# EAGLE schematic untitled (EAGLE 9.3.1)
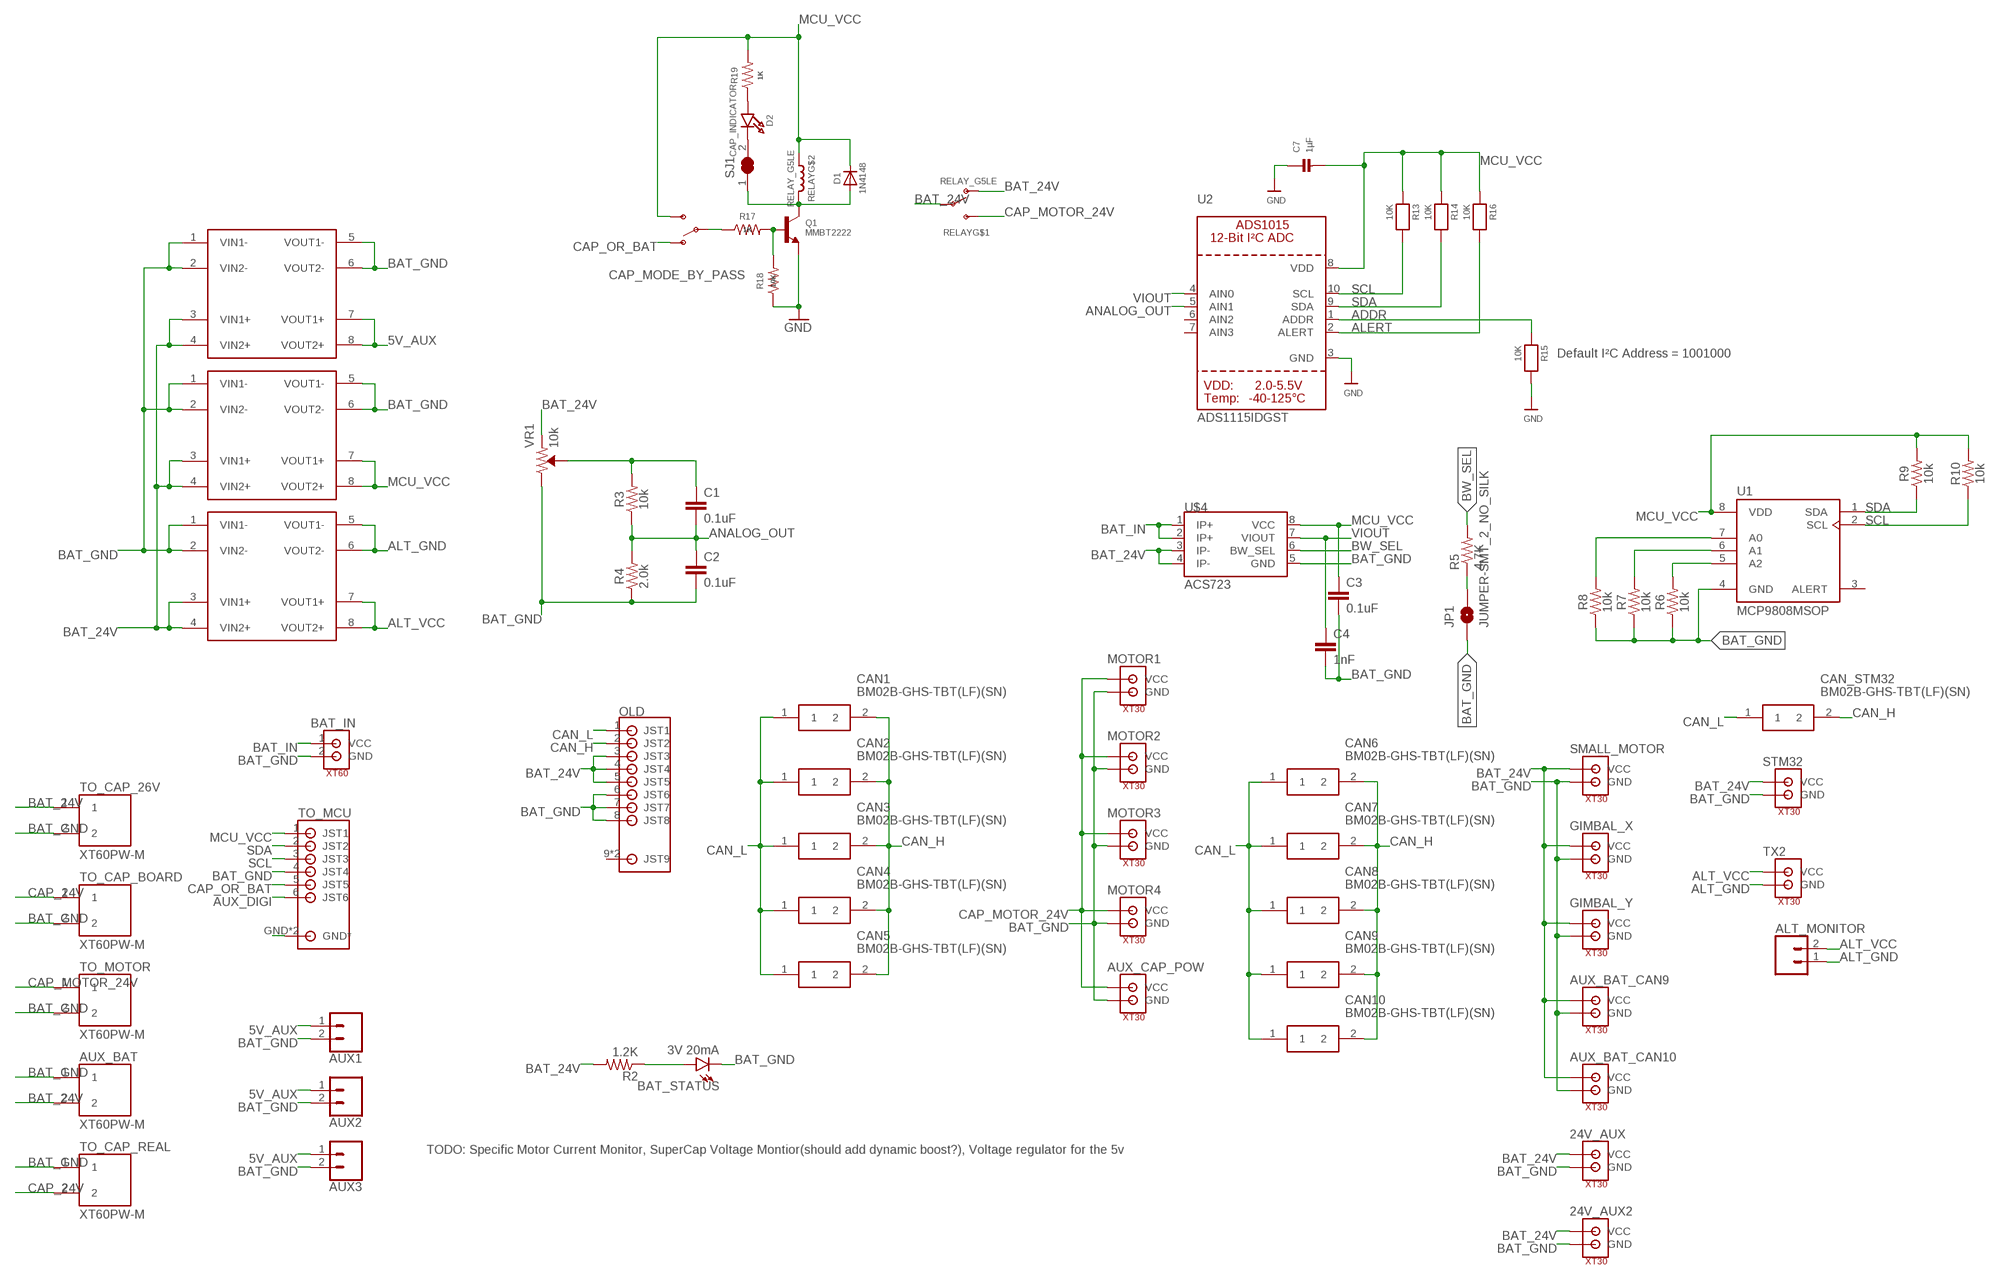
[diagram p0: schematic, sheet 1]

## Parts
24V_AUX  XT30  [XT30]
24V_AUX2  XT30  [XT30]
ALT_MONITOR  CONN_02  [1X02]
AUX1  CONN_02  [1X02]
AUX2  CONN_02  [1X02]
AUX3  CONN_02  [1X02]
AUX_BAT  XT60PW-M  [AMASS_XT60PW-M]
AUX_BAT_CAN9  XT30  [XT30]
AUX_BAT_CAN10  XT30  [XT30]
AUX_CAP_POW  XT30  [XT30]
BAT_IN  XT60  [XT60]
BAT_STATUS  3V 20mA  LED1206  [LED-1206]
C1  0.1uF  0.1UF-0603-25V-(+80/-20%)  [0603]
C2  0.1uF  0.1UF-0603-25V-(+80/-20%)  [0603]
C3  0.1uF  0.1UF-0603-25V-(+80/-20%)  [0603]
C4  1nF  1.0NF/1000PF-0603-50V-10%  [0603]
C7  1µF  CAP_CERAMIC0805  [0805]
CAN1  BM02B-GHS-TBT(LF)(SN)  [BM02B-GHS-TBT_1]
CAN2  BM02B-GHS-TBT(LF)(SN)  [BM02B-GHS-TBT_1]
CAN3  BM02B-GHS-TBT(LF)(SN)  [BM02B-GHS-TBT_1]
CAN4  BM02B-GHS-TBT(LF)(SN)  [BM02B-GHS-TBT_1]
CAN5  BM02B-GHS-TBT(LF)(SN)  [BM02B-GHS-TBT_1]
CAN6  BM02B-GHS-TBT(LF)(SN)  [BM02B-GHS-TBT_1]
CAN7  BM02B-GHS-TBT(LF)(SN)  [BM02B-GHS-TBT_1]
CAN8  BM02B-GHS-TBT(LF)(SN)  [BM02B-GHS-TBT_1]
CAN9  BM02B-GHS-TBT(LF)(SN)  [BM02B-GHS-TBT_1]
CAN10  BM02B-GHS-TBT(LF)(SN)  [BM02B-GHS-TBT_1]
CAN_STM32  BM02B-GHS-TBT(LF)(SN)  [BM02B-GHS-TBT_1]
CAP_MODE_BY_PASS  SWITCH-SPDT-SMD-RIGHT-ANGLE  [SWITCH_SPST_SMD_A]
D1  1N4148  DIODESOD-323  [SOD-323]
D2  CAP_INDICATOR  LED0805_NOOUTLINE  [CHIPLED_0805_NOOUTLINE]
GIMBAL_X  XT30  [XT30]
GIMBAL_Y  XT30  [XT30]
JP1  JUMPER-SMT_2_NO_SILK  [SMT-JUMPER_2_NO_SILK]
MOTOR1  XT30  [XT30]
MOTOR2  XT30  [XT30]
MOTOR3  XT30  [XT30]
MOTOR4  XT30  [XT30]
OLD  S8B-PH-SM4_TB  [S8B-PH-SM4_TB]
Q1  MMBT2222  TRANSISTOR_NPN  [SOT23-R]
R2  1.2K  RESISTOR2010  [R2010]
R3  10k  10KOHM-0603-1/10W-1%  [0603]
R4  2.0k  2.0KOHM-0603-1/10W-5%  [0603]
R5  4.7K  4.7KOHM-1/10W-1%(0603)  [0603-RES]
R6  10k  10KOHM-0603-1/10W-1%  [0603]
R7  10k  10KOHM-0603-1/10W-1%  [0603]
R8  10k  10KOHM-0603-1/10W-1%  [0603]
R9  10k  10KOHM-0603-1/10W-1%  [0603]
R10  10k  10KOHM-0603-1/10W-1%  [0603]
R13  10K  RESISTOR0805  [0805]
R14  10K  RESISTOR0805  [0805]
R15  10K  RESISTOR0805  [0805]
R16  10K  RESISTOR0805  [0805]
R17  1K  RESISTOR0805-RES  [0805]
R18  10K  RESISTOR0805-RES  [0805]
R19  1K  RESISTOR0805-RES  [0805]
RELAY  RELAY_G5LE  [RELAY_G5LE-1]
SJ1  SOLDERJUMPER_CLOSED  [SOLDERJUMPER_CLOSEDWIRE]
SMALL_MOTOR  XT30  [XT30]
STM32  XT30  [XT30]
TO_CAP_26V  XT60PW-M  [AMASS_XT60PW-M]
TO_CAP_BOARD  XT60PW-M  [AMASS_XT60PW-M]
TO_CAP_REAL  XT60PW-M  [AMASS_XT60PW-M]
TO_MCU  S6B-PH-SM4_TB  [S6B-PH-SM4_TB]
TO_MOTOR  XT60PW-M  [AMASS_XT60PW-M]
TX2  XT30  [XT30]
U1  MCP9808MSOP  [MSOP-8]
U2  ADS1115IDGST  ADC_ADS1015  [MSOP10]
U$1  MP1584  [MP1584_AMAZON]
U$2  MP1584  [MP1584_AMAZON]
U$4  ACS723  [SO08]
U$5  MP1584  [MP1584_AMAZON]
VR1  10k  TRIMPOT-SMD-3MM-OPEN-1/10W-25%  [TRIMPOT-SMD-TC33X]

## Nets
5V_AUX: AUX1.1 AUX2.1 AUX3.1 U$5.7(VOUT1+) U$5.8(VOUT2+)
ADDR [sig]: R15.1 U2.1(ADDR)
ALERT [sig]: R16.2 U2.2(ALERT)
ALT_GND [sig]: ALT_MONITOR.1 TX2.P$1(GND) U$2.5(VOUT1-) U$2.6(VOUT2-)
ALT_VCC [sig]: ALT_MONITOR.2 TX2.P$2(VCC) U$2.7(VOUT1+) U$2.8(VOUT2+)
ANALOG_OUT [sig]: C1.2 C2.1 R3.1 R4.2 U2.5(AIN1)
AUX_DIGI: TO_MCU.6(JST6)
BAT_24V: 24V_AUX2.P$2(VCC) 24V_AUX.P$2(VCC) AUX_BAT.2 AUX_BAT_CAN9.P$2(VCC) AUX_BAT_CAN10.P$2(VCC) GIMBAL_X.P$2(VCC) GIMBAL_Y.P$2(VCC) OLD.3(JST3) OLD.4(JST4) OLD.5(JST5) R2.2 RELAY.1(P) RELAY.3(O) SMALL_MOTOR.P$2(VCC) STM32.P$2(VCC) TO_CAP_26V.1 U$1.3(VIN1+) U$1.4(VIN2+) U$2.3(VIN1+) U$2.4(VIN2+) U$4.3(IP-) U$4.4(IP-) U$5.3(VIN1+) U$5.4(VIN2+) VR1.3(CCW)
BAT_GND: 24V_AUX2.P$1(GND) 24V_AUX.P$1(GND) AUX1.2 AUX2.2 AUX3.2 AUX_BAT.1 AUX_BAT_CAN9.P$1(GND) AUX_BAT_CAN10.P$1(GND) AUX_CAP_POW.P$1(GND) BAT_IN.2(GND) BAT_STATUS.C C2.2 C3.2 C4.2 GIMBAL_X.P$1(GND) GIMBAL_Y.P$1(GND) JP1.1 MOTOR1.P$1(GND) MOTOR2.P$1(GND) MOTOR3.P$1(GND) MOTOR4.P$1(GND) OLD.6(JST6) OLD.7(JST7) OLD.8(JST8) R4.1 R6.1 R7.1 R8.1 SMALL_MOTOR.P$1(GND) STM32.P$1(GND) TO_CAP_26V.2 TO_CAP_BOARD.2 TO_CAP_REAL.1 TO_MCU.4(JST4) TO_MOTOR.2 U1.4(GND) U$1.1(VIN1-) U$1.2(VIN2-) U$1.5(VOUT1-) U$1.6(VOUT2-) U$2.1(VIN1-) U$2.2(VIN2-) U$4.5(GND) U$5.1(VIN1-) U$5.2(VIN2-) U$5.5(VOUT1-) U$5.6(VOUT2-) VR1.1(CW)
BAT_IN: BAT_IN.1(VCC) U$4.1(IP+) U$4.2(IP+)
BW_SEL [sig]: R5.2 U$4.6(BW_SEL)
CAN_H [sig]: CAN1.2 CAN2.2 CAN3.2 CAN4.2 CAN5.2 CAN6.2 CAN7.2 CAN8.2 CAN9.2 CAN10.2 CAN_STM32.2 OLD.2(JST2)
CAN_L [sig]: CAN1.1 CAN2.1 CAN3.1 CAN4.1 CAN5.1 CAN6.1 CAN7.1 CAN8.1 CAN9.1 CAN10.1 CAN_STM32.1 OLD.1(JST1)
CAP_24V: TO_CAP_BOARD.1 TO_CAP_REAL.2
CAP_MOTOR_24V: AUX_CAP_POW.P$2(VCC) MOTOR1.P$2(VCC) MOTOR2.P$2(VCC) MOTOR3.P$2(VCC) MOTOR4.P$2(VCC) RELAY.4(S) TO_MOTOR.1
CAP_OR_BAT: CAP_MODE_BY_PASS.1(O) TO_MCU.5(JST5)
GND: C7.1 Q1.2(E) R15.2 R18.1 U2.3(GND)
MCU_VCC [sig]: C3.1 C7.2 CAP_MODE_BY_PASS.3(S) D1.C R9.2 R10.2 R13.1 R14.1 R16.1 R19.2 RELAY.2 TO_MCU.1(JST1) U1.8(VDD) U2.8(VDD) U$1.7(VOUT1+) U$1.8(VOUT2+) U$4.8(VCC)
N$1 [sig]: CAP_MODE_BY_PASS.2(P) R17.1
N$4 [sig]: JP1.2 R5.1
N$5 [sig]: BAT_STATUS.A R2.1
N$7: TO_MCU.GND2(GND*) TO_MCU.GND(GND*)
N$8 [sig]: C1.1 R3.2 VR1.2(WIPER)
N$12: D1.A Q1.3(C) RELAY.5 SJ1.1
N$13 [sig]: R8.2 U1.7(A0)
N$14 [sig]: R7.2 U1.6(A1)
N$15 [sig]: R6.2 U1.5(A2)
N$22: Q1.1(B) R17.2 R18.2
N$25: D2.C SJ1.2
N$26: D2.A R19.1
SCL [sig]: R10.1 R13.2 TO_MCU.3(JST3) U1.2(SCL) U2.10(SCL)
SDA [sig]: R9.1 R14.2 TO_MCU.2(JST2) U1.1(SDA) U2.9(SDA)
VIOUT [sig]: C4.1 U2.4(AIN0) U$4.7(VIOUT)
Unconnected: OLD.9(JST9) OLD.10(JST9) U1.3(ALERT) U2.6(AIN2) U2.7(AIN3)

## Notes on the sheet
- Default I²C Address = 1001000
- TODO: Specific Motor Current Monitor, SuperCap Voltage Montior(should add dynamic boost?), Voltage regulator for the 5v

## Library data of the parts
24V_AUX 24V_AUX2 AUX_BAT_CAN9 AUX_BAT_CAN10 AUX_CAP_POW GIMBAL_X GIMBAL_Y MOTOR1-MOTOR4 SMALL_MOTOR STM32 TX2 = NewKevinMade:XT30
ALT_MONITOR AUX1-AUX3 = SparkFun-Connectors:CONN_02: Multi connection point. Often used as Generic Header-pin footprint for 0.1 inch spaced/style header connections On any of the 0.1 inch spaced packages, you can populate with these: Break Away Headers - Straight <https://www.sparkfun.com/products/116> (PRT-00116) Break Away Male Headers - Right Angle <https://www.sparkfun.com/products/553> (PRT-00553) Female Headers <https://www.sparkfun.com/products/115> (PRT-00115) Break Away Headers - Machine Pin <https://www.sparkfun.com/products/117> (PRT-00117) Break Away Female Headers - Swiss Machine Pin <https://www.sparkfun.com/products/743> (PRT-00743) For SCREWTERMINALS and SPRING TERMINALS visit here: Screw Terimnals on SparkFun.com <https://www.sparkfun.com/search/results?term=Screw+Terminals> (5mm/3.5mm/2.54mm spacing) This device is also useful as a general connection point to wire up your design to another part of your project. Our various solder wires solder well into these plated through hole pads. Hook-Up Wire - Assortment (Stranded, 22 AWG) <https://www.sparkfun.com/products/11375> (PRT-11375) Hook-Up Wire - Assortment (Solid Core, 22 AWG) <https://www.sparkfun.com/products/11367> (PRT-11367) View the entire wire category on our website here <https://www.sparkfun.com/categories/141> Special notes: Molex polarized connector foot print use with: PRT-08233 with associated crimp pins and housings. 2.54_SCREWTERM for use with PRT-10571. 3.5mm Screw Terminal footprints for PRT-08084 5mm Screw Terminal footprints for use with PRT-08432
AUX_BAT TO_CAP_26V TO_CAP_BOARD TO_CAP_REAL TO_MOTOR = XT60PW-M:XT60PW-M; AVAILABILITY: Unavailable; MF: AMASS; MP: XT60PW-M; PACKAGE: Package Analog Devices; PRICE: None
BAT_IN = NewKevinMade:XT60
BAT_STATUS = SparkFun-LED:LED: LED (Generic) Standard schematic elements and footprints for 5mm, 3mm, 1206, and 0603 sized LEDs. Generic LEDs with no color specified.
C1-C3 = SparkFun-Capacitors:0.1UF: 0.1µF ceramic capacitors A capacitor is a passive two-terminal electrical component used to store electrical energy temporarily in an electric field.; PROD_ID: CAP-00810
C4 = SparkFun-Capacitors:1.0NF/1000PF: 1nF/1,000pF ceramic capacitors A capacitor is a passive two-terminal electrical component used to store electrical energy temporarily in an electric field.; PROD_ID: CAP-07886
C7 = microbuilder:CAP_CERAMIC: Ceramic Capacitors 0402 - 0402 Surface Mount Capacitors 16pF 50V 5% [Digikey: 445-4899-2-ND] 18pF 50V 5% [Digikey: 490-1281-2-ND] 22pF 50V 5% [Digikey: 490-1283-2-ND] 68pF 50V 5% [Digikey: 490-1289-2-ND] 0.1uF 10V 10% [Digikey: 490-1318-2-ND] 1.0uF 6.3V 10% [Digikey: 490-1320-2-ND] 0603 - 0603 Surface Mount Capacitors 16 pF 50V 5% [Digikey: 445-5051-2-ND] 22 pF 50V [Digikey: PCC220ACVTR-ND] 33 pF 50V 5% [Digikey: 490-1415-1-ND] 56pF 50V 5% [Digikey: 490-1421-1-ND] 220pF 50V 5% [Digikey: 445-1285-1-ND] 680 pF 50V 2200 pF 50V 5% C0G [Digikey: 445-1297-1-ND] 5600 pF 100V 5% X7R [Digikey: 478-3711-1-ND] 0.1 µF 25V 10% [Digikey: PCC2277TR-ND] 0.22 µF 16V 10% X7R [Digikey: 445-1318-1-ND] 1.0 µF 25V 10% [Digikey: 445-5146-2-ND] 0603 - RF Specific 3pF 250V +/-0.1pF RF [Digikey: 712-1347-1-ND] 18 pF 250V 5% [Digikey: 478-3505-1-ND or 712-1322-1-ND] 56 pF 250V 5% C0G RF [Digikey: 490-4867-1-ND] 68 pF 250V RF [Digikey: 490-4868-1-ND] 0805 - 0805 Surface Mount Capacitors 220 pF 250V 2% RF Ceramic Capacitor [Digikey: 712-1398-1-ND] 1000 pF 50V 2% NP0 Ceramic Capacitor [Digikey: 478-3760-1-ND] 0.1 µF 25V 10% Ceramic Capacitor [Digikey: PCC1828TR-ND] 1.0 µF 16V 10% Ceramic Capacitor[Digikey: 490-1691-2-ND] 10.0 µF 10V 10% Ceramic Capacitor[Digikey: 709-1228-1-ND] 10.0 uF 16V 10% Ceramic Capacitor [Digikey: 478-5165-2-ND] 47 uF 6.3V 20% Ceramic Capacitor [Digikey: 587-1779-1-ND or 399-5506-1-ND] 1206 - 1206 Surface Mount Capacitors 47uF 10V 20% Ceramic Capacitor [Digikey: 490-5528-1-ND or 399-5508-1-ND or 445-6010-1-ND] 100uF 6.3V -20%, +80% Y5V Ceramic Capacitor (Digikey: 490-4512-1-ND, Mouser: 81-GRM31CF50J107ZE1L)
CAN1-CAN10 CAN_STM32 = SamacSys_Parts:BM02B-GHS-TBT(LF)(SN): GH 1.25mm header top entry 2 way JST GH Series, 1.25mm Pitch 2 Way Shrouded Straight PCB Header, Surface Mount, Solder Termination Source: Datasheet <http://uk.rs-online.com/web/p/products/7521762P>; DESCRIPTION: GH 1.25mm header top entry 2 way JST GH Series, 1.25mm Pitch 2 Way Shrouded Straight PCB Header, Surface Mount, Solder Termination; HEIGHT: mm; MANUFACTURER_NAME: JST (JAPAN SOLDERLESS TERMINALS); MANUFACTURER_PART_NUMBER: BM02B-GHS-TBT(LF)(SN); RS_PART_NUMBER: 7521762P
CAP_MODE_BY_PASS = SparkFun-Switches:SWITCH-SPDT: Single Pole, Double Throw (SPDT) Switch Single-pole, double-throw (SPDT) switch. Variant Overview SMD-AYZ0202 Surface Mount DPDT Switch <https://www.sparkfun.com/products/597> (COM-00597) Used on e.g. LilyPad Arduino USB - ATmega32U4 Board <https://www.sparkfun.com/products/12049> PTH-11.6X4.0MM SPDT Mini Power Switch <https://www.sparkfun.com/products/102> (COM-00102) Used on e.g. SparkFun Simon Says - Through-Hole Soldering Kit <https://www.sparkfun.com/products/10547> (KIT-10547) PTH-11.6X4.0MM-KIT KIT version of SPDT Mini Power Switch - Simplifies soldering by removing tStop of switch pins - only one side can be soldered. PTH-11.6X4.0MM-LOCK LOCK version of SPDT Mini Power Switch - Offset pins hold switch in place for easier soldering. SMD-RIGHT-ANGLE Surface Mount Right Angle Switch <https://www.sparkfun.com/products/10860> (COM-10860) Used on e.g. SparkFun ESP8266 Thing <https://www.sparkfun.com/products/13231>; PROD_ID: SWCH-10651; SF_SKU: COM-10860
D1 = microbuilder:DIODE: Diode SMA Model Volts Amps Type Vf Ir Digikey # Notes SSA34-E3 40V 3A Schottky 480mV @ 3A 200uA @ 40V SSA34-E3/61TGITR-ND CDBA120-G 20V 1A Schottky 500mV @ 1A 500uA @ 20V 641-1014-6-ND REEL MBRA210 10V 2A Schottky 350mV @ 2A 700uA @ 10V MBRA210LT3 SOD-123 Model Volts Amps Type Vf Ir Order # Notes BAT54T1G 30V 200mA Schottky 800mV @ 200mA 2uA @ 25V BAT54T1GOSTR-ND B0530W 30V 500mA Schottky 430mV @ 500mA 130uA @ 30V B0530W-FDICT-ND REEL MBR120 20V 1A Schottky 340mV @ 1A MBR120VLSFT1GOSCT-ND SOD-323 Model Volts Amps Type Vf Ir Order # Notes PMEG2005EJ 20V 500mA Schottky 355mV @ 500mA 568-4110-1-ND ZLLS410 10V 570mA Schottky 380mV @ 570mA ZLLS410CT-ND 1N4148WS 75V 150mA Silicon/Simple 1V 1N4148WSFSCT-ND REEL SOD-523 Model Volts Amps Type Vf Ir Order # Notes BAT54XV2 30V 200mA Schottky 0.8V @ 100mA BAT54XV2CT-ND TB751S 30V 30mA Schottky RB751S-40TE61CT-ND SOT23-R/W (R = Solder Paste/Reflow Ovens, W = Hand-Soldering) Model Volts Amps Type Vf Ir Order # Notes BAT54FILM 40V 300mA Schottky 497-7162-1-ND POWERDI-5 Model Volts Amps Type Vf Ir Order # Notes PDS560 60V 5A Schottky 670mV @ 5A 150uA @ 60V PDS560DICT-ND
D2 = microbuilder:LED: LED 0603 - 0603 Surface Mount Package 2mA: Green LED - Low Power (3.9mcd, 2ma, 1.7Vf) - Digikey: 475-2709-2-ND Orange LED - Low Power (9.8mcd, 2ma, 1.8Vf) - Digikey: 475-1194-2-ND Red LED - Low Power (5mcd, 2ma, 1.8Vf) - Digikey: 475-1195-2-ND Yellow LED - Low Power (7mcd, 2ma, 1.8Vf) - Digikey: 475-1196-2-ND 5mA: Blue LED - Low Power (17mcd, 5ma, 2.9Vf) - Digikey: LNJ937W8CRACT-ND 0805 - 0805 Surface Mount Package 2mA: Red LED (8.8mcd, 2mA, 1.8Vf, Clear) - Low Power [Digikey: 475-2510-1-ND] Green LED (5mcd, 2mA, 1.8Vf, Clear) - Low Power [Digikey: 475-2730-1-ND] Yellow LED (11.3mcd, 2mA, 1.8Vf, Clear) - Low Power [Digikey: 475-2555-1-ND] 20mA: Red LED (104mcd, 20mA, Diffused) - LS R976 [Digikey: 475-1278-6-ND] Red LED (12mcd, 20mA, 2.0Vf, Clear) - APT2012EC [Digikey: 754-1128-1-ND] Green LED (15mcd, 20mA, 2.2Vf, Clear) - APT2012GC [Digikey: 754-1131-1-ND] Orange LED (160mcd, 20mA, 2.1Vf, Clear) - APT2012SECK [Digikey: 754-1130-1-ND] 1206 - 1206 Surface Mount Package Green LED (26mcd, 20mA, Diffused) - LG N971 [Digikey: 475-1407-6-ND] Red LED (15mcd, 20mA, Diffused) - LH N974 [Digikey: 475-1416-6-ND] Cree - Cree High-Power Surface Mount LEDs XPEBWT-L1-0000-00D50 - White 111lm 350mA 2.9Vf 6200K 110° XTEAWT-00-0000-00000LEE3 - White 114lm 350mA 2.85Vf 5000K 115° Everlight - Everlight 45-21 Series Surface Mount LEDs 45-21/QK2C-B2832AC2CB2/2T - Warm White 2000mcd 20mA 3.25Vf 3050K 120° 45-21/LK2C-B38452C4CB2/2T - Nuetral White 2000mcd 20mA 3.25Vf 4150K 120° 45-21/LK2C-B50634C6CB2/2T - Cold White 2200mcd 20mA 3.25Vf 5650K 120° PLCC2 Reverse Mount LS T77K-J1L2-1-0-2-R18-Z - Red 11.25mcd 2mA 1.8Vf 630nm 120° LO T77K-L1M2-24-Z - Orange 19.6mcd 2mA 1.8Vf 606nm 120° LY T77K-K2M1-26-Z - Yellow 15.7mcd 2mA 1.8Vf 587nm 120°
JP1 = SparkFun-Jumpers:JUMPER-SMT_2_NO: Normally open jumper This jumper has two pads in close proximity to each other. Apply solder to close the connection. Round pads are easier to solder for beginners, but are a lot larger. SparkFun Product that uses the round pads: SparkFun EL Sequencer <https://www.sparkfun.com/products/12781>
OLD = KevinMade:S8B-PH-SM4_TB
Q1 = microbuilder:TRANSISTOR_NPN: NPN Transistor Transistor (NPN) 500mA 45V - BC817 [Digikey: 568-1631-1-ND] Transistor (NPN) 500mA 45V - BC817,215 [Mouser: 771-BC817-T/R] SOT23-R - SOT23 footprint optimised for use with solder paste and reflow ovens. SOT23-W - SOT23 footprint optimised for hand-soldering (larger pads).
R2 = SparkFun-Passives:RESISTOR: Resistor Basic schematic elements and footprints for 0603, 1206, and PTH resistors.
R3 R6-R10 = SparkFun-Resistors:10KOHM: 10kΩ resistor A resistor is a passive two-terminal electrical component that implements electrical resistance as a circuit element. Resistors act to reduce current flow, and, at the same time, act to lower voltage levels within circuits. - Wikipedia; PROD_ID: RES-00824
R4 = SparkFun-Resistors:2.0KOHM: 2kΩ resistor A resistor is a passive two-terminal electrical component that implements electrical resistance as a circuit element. Resistors act to reduce current flow, and, at the same time, act to lower voltage levels within circuits. - Wikipedia; PROD_ID: RES-08296
R5 = SparkFun-Resistors:4.7KOHM-1/10W-1%(0603): RES-07857; PROD_ID: RES-07857
R13-R16 = microbuilder:RESISTOR: Resistors 0402 - 0402 Surface Mount Package 22 Ohm 1% 1/16W [Digikey: 311-22.0LRTR-ND] 33 Ohm 5% 1/16W 1.0K 5% 1/16W 1.5K 5% 1/16W 2.0K 1% 1/16W 10.0K 1% 1/16W [Digikey: 311-10.0KLRTR-ND] 10.0K 5% 1/16W [Digikey: RMCF0402JT10K0TR-ND] 12.1K 1% 1/16W [Digikey: 311-22.0LRTR-ND] 100.0K 5% 1/16W 0603 - 0603 Surface Mount Package 0 Ohm 1/10 Watt 1% Resistor 15 Ohm 1/10 Watt 1% Resistor 33 Ohm 1/10 Watt 1% Resistor 49.9 Ohm 1/10 Watt 1% Resistor 100 Ohm 1/10 Watt 1% Resistor 150 Ohm 1/10 Watt 1% Resistor 240 Ohm 1/10 Watt 1% Resistor 390 Ohm 1/10 Watt 1% Resistor 560 Ohm 1/10 Watt 1% Resistor 680 Ohm 1/10 Watt 1% Resistor 750 Ohm 1/10 Watt 1% Resistor 1.0K Ohm 1/10 Watt 1% Resistor 1.5K Ohm 1/10 Watt 1% Resistor 2.0K Ohm 1/10 Watt 1% Resistor 2.2K Ohm 1/10 Watt 1% Resistor 3.3K Ohm 1/10 Watt 1% Resistor 4.7K Ohm 1/10 Watt 1% Resistor 10.0K Ohm 1/10 Watt 1% Resistor 12.0K Ohm 1/10 Watt 1% Resistor 12.1K Ohm 1/10 Watt 1% Resistor 20.0K Ohm 1/10 Watt 1% Resistor 33.0K Ohm 1/10 Watt 1% Resistor 100.0K Ohm 1/10 Watt 1% Resistor 0805 - 0805 Surface Mount Package 0 Ohm 1/8 Watt 1% Resistor 33 Ohm 1/8 Watt 1% Resistor 100 Ohm 1/8 Watt 1% Resistor 150 Ohm 1/8 Watt 1% Resistor 200 Ohm 1/8 Watt 1% Resistor 240 Ohm 1/8 Watt 1% Resistor 330 Ohm 1/8 Watt 1% Resistor 390 Ohm 1/8 Watt 1% Resistor 470 Ohm 1/8 Watt 1% Resistor 1.0K Ohm 1/8 Watt 1% Resistor 1.5K Ohm 1/8 Watt 1% Resistor 2.0K Ohm 1/8 Watt 1% Resistor 4.7K Ohm 1/8 Watt 1% Resistor 5.1K Ohm 1/8 Watt 1% Resistor 5.6K Ohm 1/8 Watt 1% Resistor 10.0K Ohm 1/8 Watt 1% Resistor 22.0K Ohm 1/8 Watt 1% Resistor 33.0K Ohm 1/8 Watt 1% Resistor 100K Ohm 1/8 Watt 1% Resistor 1206 - 1206 Surface Mount Package 2012 - 2010 Surface Mount Package 0.11 Ohm 1/2 Watt 1% Resistor - Digikey: RHM.11UCT-ND
R17-R19 = SparkFun-Resistors:RESISTOR: Resistor Basic schematic elements and footprints for 0603, 1206, and PTH resistors.
RELAY = microbuilder:RELAY_G5LE
SJ1 = microbuilder:SOLDERJUMPER_CLOSED: Solder Jumper - Closed These solder jumpers are closed by default CLOSEDWIRE - 10 mil trace between pads that can be cut and resoldered later CLOSEDPERM - 63 mil trace between pads for a permanent connection (used to 'bridge' two signals, a shameless hack for Eagle). Can double as a test point as well (no cream layer)
TO_MCU = NewKevinMade:S6B-PH-SM4_TB
U1 = MCP9808:MCP9808; AVAILABILITY: Unavailable; DESCRIPTION: MCP9808 Series SMD 3.6 V Memory Module Digital Temperature Sensor - MSOP-8; MF: Microchip; MP: MCP9808-E/MS; PACKAGE: MSOP-8 Microchip; PRICE: None
U2 = microbuilder:ADC_ADS1015: ADS1015 - 12-bit 4-Channel I2C ADC with Internal PGA VDD: 2.0-5.5V Sampling Rate: 3.3ksps Gain Settings: 2/3, 1, 2, 4, 8, 16 I2C Address: ADDR low = 1001000x, ADDR high = 1001001x Internal Comparator The ADS1015 includes an internal comparator that can be set to output a high-level on ALERT when the conversion results exceeeds a pre-defined upper level, and will deassert itself when the level falls below a pre-defined lower threshold level. It can also be set to windowed mode where the ALERT pin will be asserted if the data exceeds the upper threshold or falls below the lower threshold.
U$1 U$2 U$5 = NewKevinMade:MP1584
U$4 = SparkFun-Sensors:ACS723; PART_#: ACS723ACS723LLCTR-05AB-T2; PROD_ID: IC-13872
VR1 = SparkFun-Resistors:TRIMPOT: Trimming Potentiometer (Trimpot) Three-terminal potentiometers, with an adjustable wiper and two adjustable resistors. A pot can be used to create a configurable voltage divider, or as a variable resistor. "Trimpots" are a subset of potentiometers, usually intended for "set-and-forget" applications. They're often more delicate than standard potentiometers - rated for fewer turns. Variants PTH-KNOB - PTH Trimpot w/ finger-adjustable knob Trimpot 10K with Knob <https://www.sparkfun.com/products/9806> (COM-09806) Datasheet <http://www.sparkfun.com/datasheets/Components/General/TSR-3386.pdf> SMD-3MM-CLOSED-FRAME - SMD 3mm Square Closed-Frame Trimpot Used on e.g. EasyDriver - Stepper Motor Driver <https://www.sparkfun.com/products/12779> Datasheet <http://www.bitechnologies.com/pdfs/22.pdf> (22AR10KTR) SMD-5MM - SMD 5mm Square Closed-Frame Trimpot Used on e.g. IOIO-OTG - V2.2 <https://www.sparkfun.com/products/13613> Datasheet <http://www.vishay.com/docs/51008/ts53.pdf> (TS53YL502MR10) SMD-3MM-1/10W-25% - 3mm Square Open-Frame Trimpot Used on e.g. SparkFun Shapeoko <https://www.sparkfun.com/products/13899> Datasheet <http://www.bourns.com/docs/Product-Datasheets/TC33.pdf> (TC33X-2-103E); PROD_ID: RES-12428, RES-08048

## Net classes
0 default: width 0.508 mm, drill 0.254 mm, clearance 0.508 mm
1 sig: width 0.254 mm, drill 0.305 mm, clearance 0.127 mm